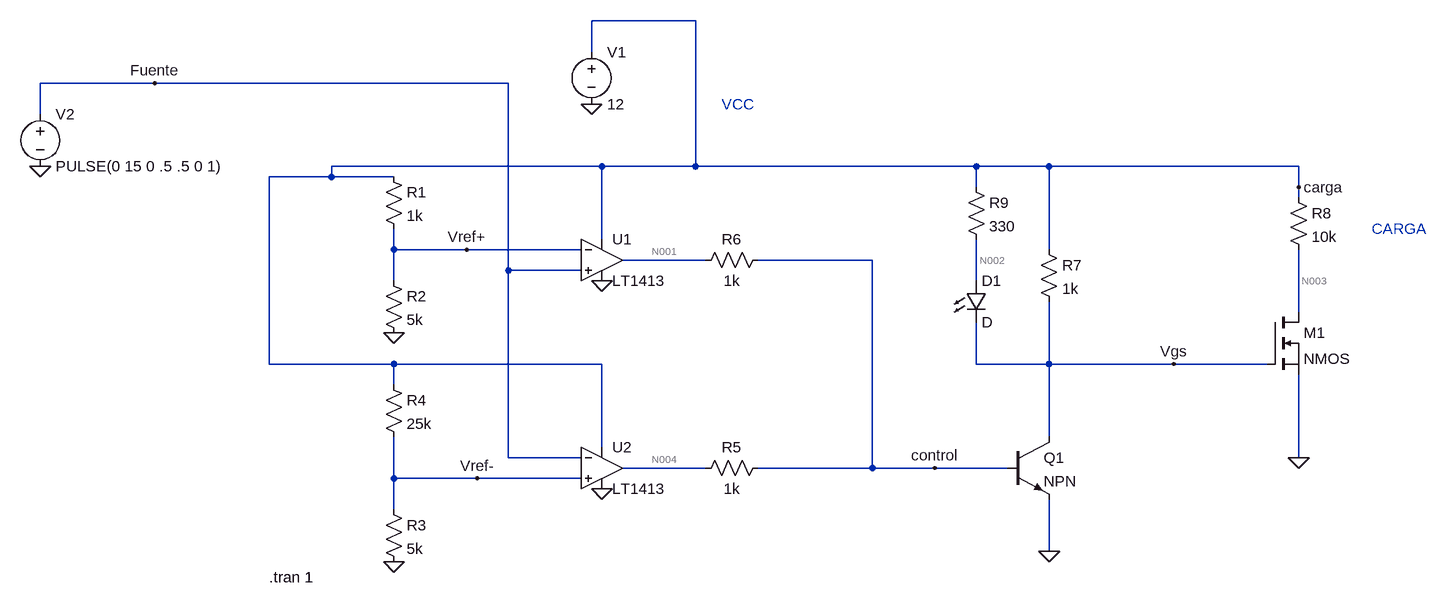
[diagram p0: schematic lab5Supervisontensionv2.asc]
lab5Supervisontensionv2.asc, the LTspice schematic file:
Version 4
SHEET 1 1540 804
WIRE 416 -192 256 -192
WIRE 256 -144 256 -192
WIRE -416 -96 -592 -96
WIRE 128 -96 -416 -96
WIRE -592 -48 -592 -96
WIRE 272 32 -144 32
WIRE 416 32 416 -192
WIRE 416 32 272 32
WIRE 848 32 416 32
WIRE 960 32 848 32
WIRE 1344 32 960 32
WIRE -144 48 -144 32
WIRE -144 48 -240 48
WIRE -48 48 -144 48
WIRE 848 64 848 32
WIRE 1344 64 1344 32
WIRE 1344 80 1344 64
WIRE 272 144 272 32
WIRE -48 160 -48 128
WIRE 64 160 -48 160
WIRE 240 160 64 160
WIRE 960 160 960 32
WIRE 432 176 304 176
WIRE 688 176 512 176
WIRE 128 192 128 -96
WIRE 240 192 128 192
WIRE -48 208 -48 160
WIRE 848 208 848 144
WIRE 1344 256 1344 160
WIRE -240 336 -240 48
WIRE -48 336 -240 336
WIRE 272 336 -48 336
WIRE 848 336 848 272
WIRE 960 336 960 240
WIRE 960 336 848 336
WIRE 1152 336 960 336
WIRE 1296 336 1152 336
WIRE -48 368 -48 336
WIRE 960 448 960 336
WIRE 272 464 272 336
WIRE 128 480 128 192
WIRE 240 480 128 480
WIRE 1344 480 1344 352
WIRE 432 496 304 496
WIRE 688 496 688 176
WIRE 688 496 512 496
WIRE 784 496 688 496
WIRE 896 496 784 496
WIRE -48 512 -48 448
WIRE 80 512 -48 512
WIRE 240 512 80 512
WIRE -48 560 -48 512
WIRE 960 624 960 544
FLAG -48 640 0
FLAG -48 288 0
FLAG 272 208 0
FLAG 272 528 0
FLAG 960 624 0
FLAG 256 -64 0
FLAG -592 32 0
FLAG 1344 480 0
FLAG 1344 64 carga
FLAG 784 496 control
FLAG -416 -96 Fuente
FLAG 1152 336 Vgs
FLAG 64 160 Vref+
FLAG 80 512 Vref-
SYMBOL OpAmps\\LT1413 272 112 R0
SYMATTR InstName U1
SYMBOL OpAmps\\LT1413 272 432 R0
SYMATTR InstName U2
SYMBOL res -64 32 R0
SYMATTR InstName R1
SYMATTR Value 1k
SYMBOL res -64 192 R0
SYMATTR InstName R2
SYMATTR Value 5k
SYMBOL res -64 544 R0
SYMATTR InstName R3
SYMATTR Value 5k
SYMBOL res -64 352 R0
SYMATTR InstName R4
SYMATTR Value 25k
SYMBOL res 528 480 R90
WINDOW 0 0 56 VBottom 2
WINDOW 3 32 56 VTop 2
SYMATTR InstName R5
SYMATTR Value 1k
SYMBOL res 528 160 R90
WINDOW 0 0 56 VBottom 2
WINDOW 3 32 56 VTop 2
SYMATTR InstName R6
SYMATTR Value 1k
SYMBOL npn 896 448 R0
SYMATTR InstName Q1
SYMBOL res 944 144 R0
SYMATTR InstName R7
SYMATTR Value 1k
SYMBOL voltage 256 -160 R0
WINDOW 123 0 0 Left 0
WINDOW 39 0 0 Left 0
SYMATTR InstName V1
SYMATTR Value 12
SYMBOL voltage -592 -64 R0
WINDOW 123 0 0 Left 0
WINDOW 39 0 0 Left 0
SYMATTR InstName V2
SYMATTR Value PULSE(0 15 0 .5 .5 0 1)
SYMBOL nmos 1296 256 R0
SYMATTR InstName M1
SYMBOL res 1328 64 R0
SYMATTR InstName R8
SYMATTR Value 10k
SYMBOL res 832 48 R0
SYMATTR InstName R9
SYMATTR Value 330
SYMBOL LED 832 208 R0
SYMATTR InstName D1
TEXT 456 -64 Left 2 ;VCC
TEXT -240 664 Left 2 !.tran 1
TEXT 1456 128 Left 2 ;CARGA

The netlist it stands for:
* lab5Supervisontensionv2.asc
XU1 Fuente Vref+ carga 0 N001 LT1413  ; pins In+ In- V+ V- OUT
XU2 Vref- Fuente carga 0 N004 LT1413  ; pins In+ In- V+ V- OUT
R1 carga Vref+ 1k
R2 Vref+ 0 5k
R3 Vref- 0 5k
R4 carga Vref- 25k
R5 control N004 1k
R6 control N001 1k
Q1 Vgs control 0 0 NPN
R7 carga Vgs 1k
V1 carga 0 12
V2 Fuente 0 PULSE(0 15 0 .5 .5 0 1)
M1 N003 Vgs 0 0 NMOS
R8 carga N003 10k
R9 carga N002 330
D1 N002 Vgs D
.model D D
.lib standard.dio
.model NPN NPN
.model PNP PNP
.lib standard.bjt
.model NMOS NMOS
.model PMOS PMOS
.lib standard.mos
* VCC
.tran 1
* CARGA
.lib LTC.lib
.backanno
.end

* Results of the author's LTspice run, read from the files saved beside the schematic
* Operating Point, zero values left out:
*   V(vref+) = 10 V
*   V(n001) = 118.9 mV
*   V(vref-) = 2 V
*   V(control) = 882.2 mV
*   V(n002) = 796 mV
*   V(carga) = 12 V
*   V(n004) = 11.8 V
*   V(vgs) = 49.69 mV
*   V(n003) = 12 V
*   I(R3) = 400 µA
*   I(R6) = 763.2 µA
*   I(R7) = 11.95 mA
*   I(V1) = -59.28 mA
*   Id(M1) = 24.72 nA
*   Is(M1) = -24.71 nA
*   Ib(M1) = -12.01 pA
*   I(R1) = 2 mA
*   I(D1) = 33.95 mA
*   I(R2) = 2 mA
*   I(R4) = 400 µA
*   I(R5) = -10.92 mA
*   Ic(Q1) = 45.9 mA
*   Ib(Q1) = 10.15 mA
*   Ie(Q1) = -56.06 mA
*   I(R8) = 24.72 nA
*   I(R9) = 33.95 mA
*   I(V2) = 52.79 nA
*   Ix(u2:1) = -7.803 nA
*   Ix(u2:2) = -17.2 nA
*   Ix(u2:3) = 10.92 mA
*   Ix(u2:4) = -242.4 pA
*   Ix(u2:5) = -10.92 mA
*   Ix(u1:1) = -35.59 nA
*   Ix(u1:2) = 11.39 nA
*   Ix(u1:3) = 60.56 µA
*   Ix(u1:4) = -822.3 µA
*   Ix(u1:5) = 763.2 µA
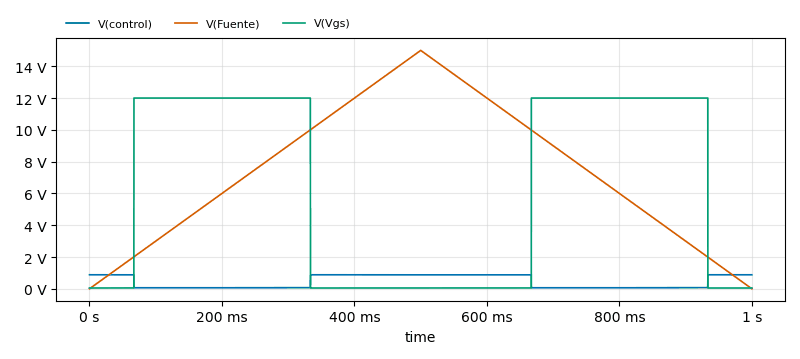
[diagram p1: Transient Analysis of lab5Supervisontensionv2.asc, plotted from the saved traces]
* Transient Analysis, 1 run:
*   V(control): min 64.4 mV, max 882.2 mV, average 446.5 mV, rms 604.8 mV, last 882.2 mV
*   V(Fuente): min 0 V, max 15 V, average 7.5 V, rms 8.672 V, last 0 V
*   V(Vgs): min 49.69 mV, max 12 V, average 6.418 V, rms 8.76 V, last 49.69 mV